# Altium schematic sheet Sheet1.SchDoc
size A4; SheetNumber: 1; SheetTotal: 1
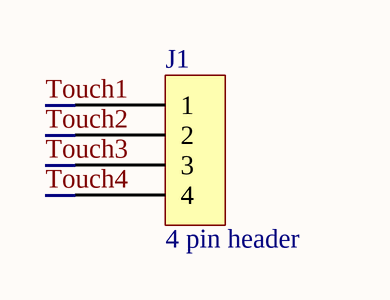
[diagram p0: Sheet1.SchDoc]

## Parts
J1  4 pin header  [4 pin header]

## Nets
Touch1: J1.1
Touch2: J1.2
Touch3: J1.3
Touch4: J1.4

## Library data of the parts
J1 = 4PinHeader: Manufacturer: Sullins Connector Solutions; Part Number: 4PinHeader; SCH_Comment: 4 pin header; Supplier 1: Digi-Key; Supplier Part Number 1: S7002-ND